# EAGLE design Gimbal IMU Board (EAGLE 8.4.1)
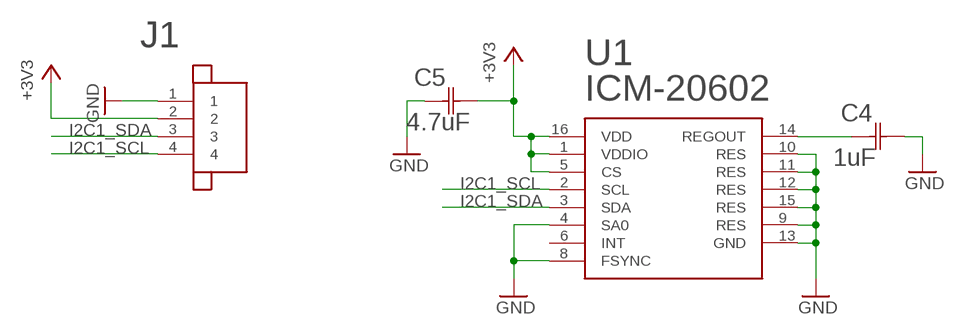
[diagram p0: schematic, sheet 1]

## Parts
C4  1uF  CC0805KKX7R7BB105  [YAG_CC0805]
C5  4.7uF  06036D475KAT2A0603-M  [0603-M]
J1  JST_SH_4POS  [JST_SH_4POS]
U1  ICM-20602  [16LGA]

## Nets
+3V3: C5.2 J1.2 U1.1(VDDIO) U1.5(CS) U1.16(VDD)
GND: C4.2 C5.1 J1.1 U1.4(SA0) U1.8(FSYNC) U1.9(RES) U1.10(RES) U1.11(RES) U1.12(RES) U1.13(GND) U1.15(RES)
I2C1_SCL: J1.4 U1.2(SCL)
I2C1_SDA: J1.3 U1.3(SDA)
N$11: C4.1 U1.14(REGOUT)
Unconnected: U1.6(INT)

## Library data of the parts
C4 = 1uF X7R Ceramic Capacitor:CC0805KKX7R7BB105; COPYRIGHT: Copyright C 2015 Accelerated Designs. All rights reserved; MANUFACTURER_PART_NUMBER: CC0805KKX7R7BB105; VENDOR: Vendor
C5 = 4.7uF-capacitor:06036D475KAT2A; MANUFACTURER_PART_NUMBER: 06036D475KAT2A; VENDOR: AVX Corporation
J1 = thanics_robotics:JST_SH_4POS
U1 = thanics_robotics:ICM-20602

## Board
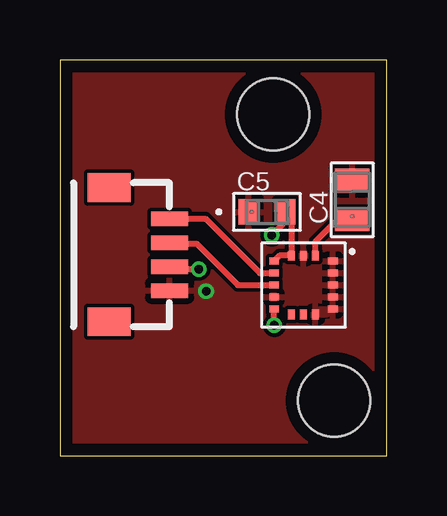
[diagram p1: board, top side]
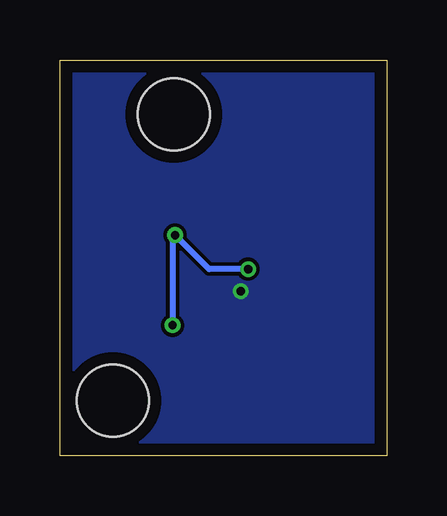
[diagram p2: board, bottom side, seen from below]

Size 13.64 x 16.5 mm. Coordinates in mm from the lower left corner, seen from the top.
Outline: 0,0 13.64,0 13.64,16.5 0,16.5 0,0
Copper layers (1*16): Top 0.035mm / dielectric 1.6mm / Bottom 0.035mm
Design rules "Elecrow_2-layer_PCB_eagle_rule": minimum track width 6mil, minimum drill 12mil, track to track 6mil, track to pad 6mil, pad to pad 6mil, via to via 8mil, smd to smd 0mil, copper to edge 20mil, drill to drill 10mil, minimum pad ring 6mil, minimum via ring 6mil, stop-mask expansion 0mil, vias tented up to drill 100mil, thermal gap 10mil
Holes 3 mm at 8.89,14.22 11.43,2.29

### Footprints (pad centres in the part's own frame; a part is rotated, then mirrored left to right if it is on the bottom)
YAG_CC0805 = smd 0.965 x 1.448: 1 -0.826,0; 2 0.826,0
0603-M = smd 0.813 x 1.067: 1 -0.775,0; 2 0.775,0
JST_SH_4POS = smd 0.6 x 1.55: 1 -1.5,0; 2 -0.5,0; 3 0.5,0; 4 1.5,0 | smd 1.2 x 1.8: P$5 -2.8,2.525; P$6 2.8,2.525
16LGA = smd 0.4 x 0.3: 1 -1.225,1; 2 -1.225,0.5; 3 -1.225,0; 4 -1.225,-0.5; 5 -1.225,-1; 9 1.225,-1; 10 1.225,-0.5; 11 1.225,0; 12 1.225,0.5; 13 1.225,1 | smd 0.3 x 0.4: 6 -0.5,-1.225; 7 0,-1.225; 8 0.5,-1.225; 14 0.5,1.225; 15 0,1.225; 16 -0.5,1.225

### Placement (x,y rotation side)
C4  12.19,10.67 90 top
C5  8.64,10.16 0 top
J1  4.57,8.38 90 top
U1  10.16,7.11 0 top

### Tracks (layer width: path | path; a pad name or v marks a point on that pad's centre or on a via)
+3V3  (via drill 0.35)
  Top 0.254: J1.2 4.68,7.77 v5.79,7.77 | v8.84,9.2 9.41,9.77 C5.2 9.66,9.91 U1.16 9.16,8.34 U1.1 | v8.94,5.44 U1.5
  Bottom 0.254: v5.79,7.77 7.42,7.77 v8.84,9.2 8.94,9.09 v8.94,5.44
GND  (via drill 0.35)
  other vias: 6.1,6.86
  pour Top: 0,16.51 13.72,16.51 13.72,0 0,0
  pour Bottom: 0,16.51 13.72,16.51 13.72,0 0,0
I2C1_SCL
  Top 0.254: J1.4 6.07,9.88 8.34,7.61 U1.2
I2C1_SDA
  Top 0.254: J1.3 4.62,8.84 5.69,8.84 7.42,7.11 U1.3
N$11
  Top 0.254: U1.14 10.66,8.93 11.57,9.84 C4.1